# Altium schematic sheet [04] - MECANICO.SchDoc
size A4; DocumentNumber: 4; SheetNumber: 4; SheetTotal: 6
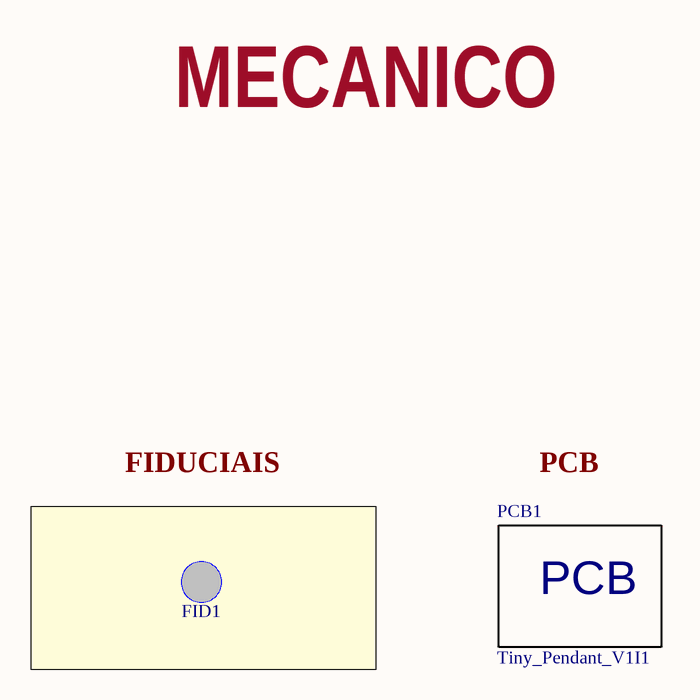
[diagram p0: [04] - MECANICO.SchDoc]

## Parts
FID1  FIDUCIAL  [FIDUCIAL - 1.27mm]  (value not drawn)  (no BOM)
PCB1  Tiny_Pendant_V1I1

## Blocks framed on the sheet
FIDUCIAIS: FID1

## Notes on the sheet
- MECANICO
- PCB
- Projeto:
- Ancient Egypt Ltda
- Revisão:
- Engenheiro:
- Titulo:
- Pág
- de
- Pyramides of Giza, 777
- Cairo
- www.ancientegypt.com.eg
- Data:
- Hora:
- Variante:

## Library data of the parts
FID1 = FIDUCIAL: Pad size: 1.27mm; Value: FIDUCIAL
PCB1 = PCB: Printed Circuit Board; Category: Printed Circuit Board